# Altium schematic sheet Offboard.SchDoc: QUTMS HVBoard V1.1 - Offboard
size A4; Author: Jonn Dillon; Organization: QUT Motorsport; Address1: O-120; Address2: O Block; Address3: QUT Gardens Point; Address4: Brisbane, 4000; DocumentNumber: 8; SheetNumber: 8; SheetTotal: 8
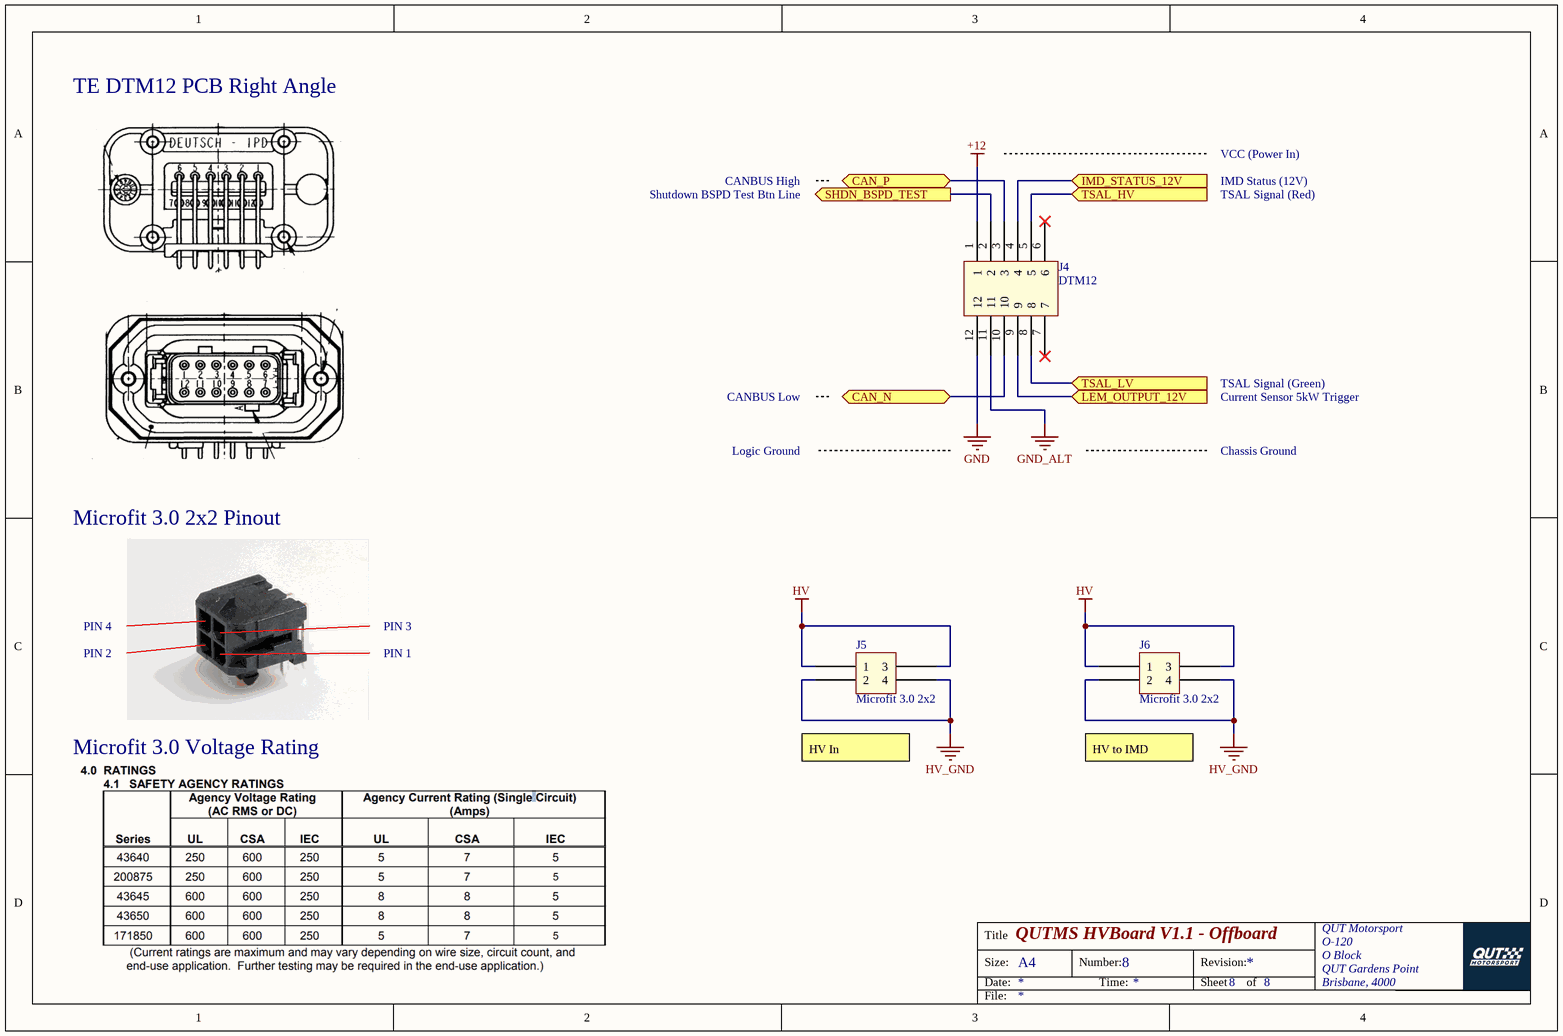
[diagram p0: Offboard.SchDoc]

## Parts
J4  DTM12  [DTM13-12PA]
J5  Microfit 3.0 2x2  [Microfit_2X2_R_TH]
J6  Microfit 3.0 2x2  [Microfit_2X2_R_TH]

## Ports
CAN_N (bidir), CAN_P (bidir), IMD_STATUS_12V (in), LEM_OUTPUT_12V (in), SHDN_BSPD_TEST (out), TSAL_HV (in), TSAL_LV (in)

## Nets
+12: J4.1
GND: J4.12
GND_ALT: J4.11
HV: J5.1 J5.3 J6.1 J6.3
HV_GND: J5.2 J5.4 J6.2 J6.4
CAN_N: J4.10 ; port CAN_N
CAN_P: J4.3 ; port CAN_P
IMD_STATUS_12V: J4.4 ; port IMD_STATUS_12V
LEM_OUTPUT_12V: J4.9 ; port LEM_OUTPUT_12V
SHDN_BSPD_TEST: J4.2 ; port SHDN_BSPD_TEST
TSAL_HV: J4.5 ; port TSAL_HV
TSAL_LV: J4.8 ; port TSAL_LV

Not connected (* = marked no-connect by the designer): J4 6* 7*

## Notes on the sheet
- TE DTM12 PCB Right Angle
- CANBUS High
- IMD Status (12V)
- VCC (Power In)
- Shutdown BSPD Test Btn Line
- TSAL Signal (Red)
- TSAL Signal (Green)
- CANBUS Low
- Logic Ground
- Chassis Ground
- Current Sensor 5kW Trigger
- Microfit 3.0 2x2 Pinout
- PIN 2
- PIN 4
- PIN 1
- PIN 3
- Microfit 3.0 Voltage Rating
- HV In
- HV to IMD
- Title
- Size:
- Date:
- A4
- Number:
- Time:
- Revision:
- Sheet
- of
- File:

## Library data of the parts
J5 J6 = Microfit_2x2